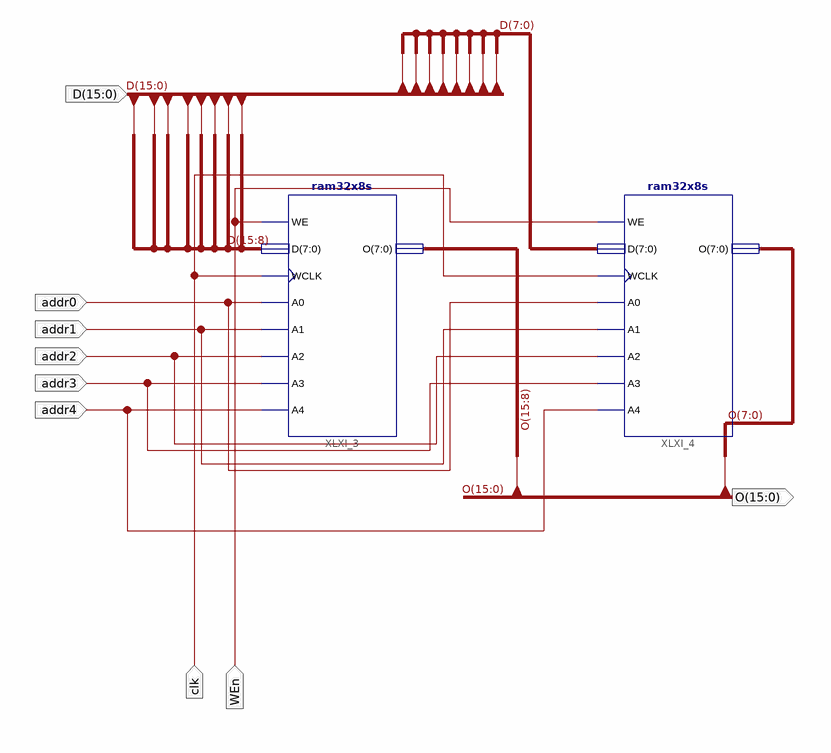
[diagram p0: schematic sheet 1]
// Xilinx ISE schematic RAM32X16S.sch (spartan3e) as structural Verilog: 2 symbols, 9 ports
module RAM32X16S (
  input  [15:0] D,
  input  addr0,
  input  addr1,
  input  addr2,
  input  addr3,
  input  addr4,
  input  WEn,
  input  clk,
  output [15:0] O
);

  ram32x8s XLXI_3 (
    .A0(addr0), .A1(addr1), .A2(addr2), .A3(addr3), .A4(addr4), .D(D[15:8]), .WCLK(clk), .WE(WEn), .O(O[15:8]));
  ram32x8s XLXI_4 (
    .A0(addr0), .A1(addr1), .A2(addr2), .A3(addr3), .A4(addr4), .D(D[7:0]), .WCLK(clk), .WE(WEn), .O(O[7:0]));
endmodule
